# EAGLE design firely (EAGLE 7.7.0)
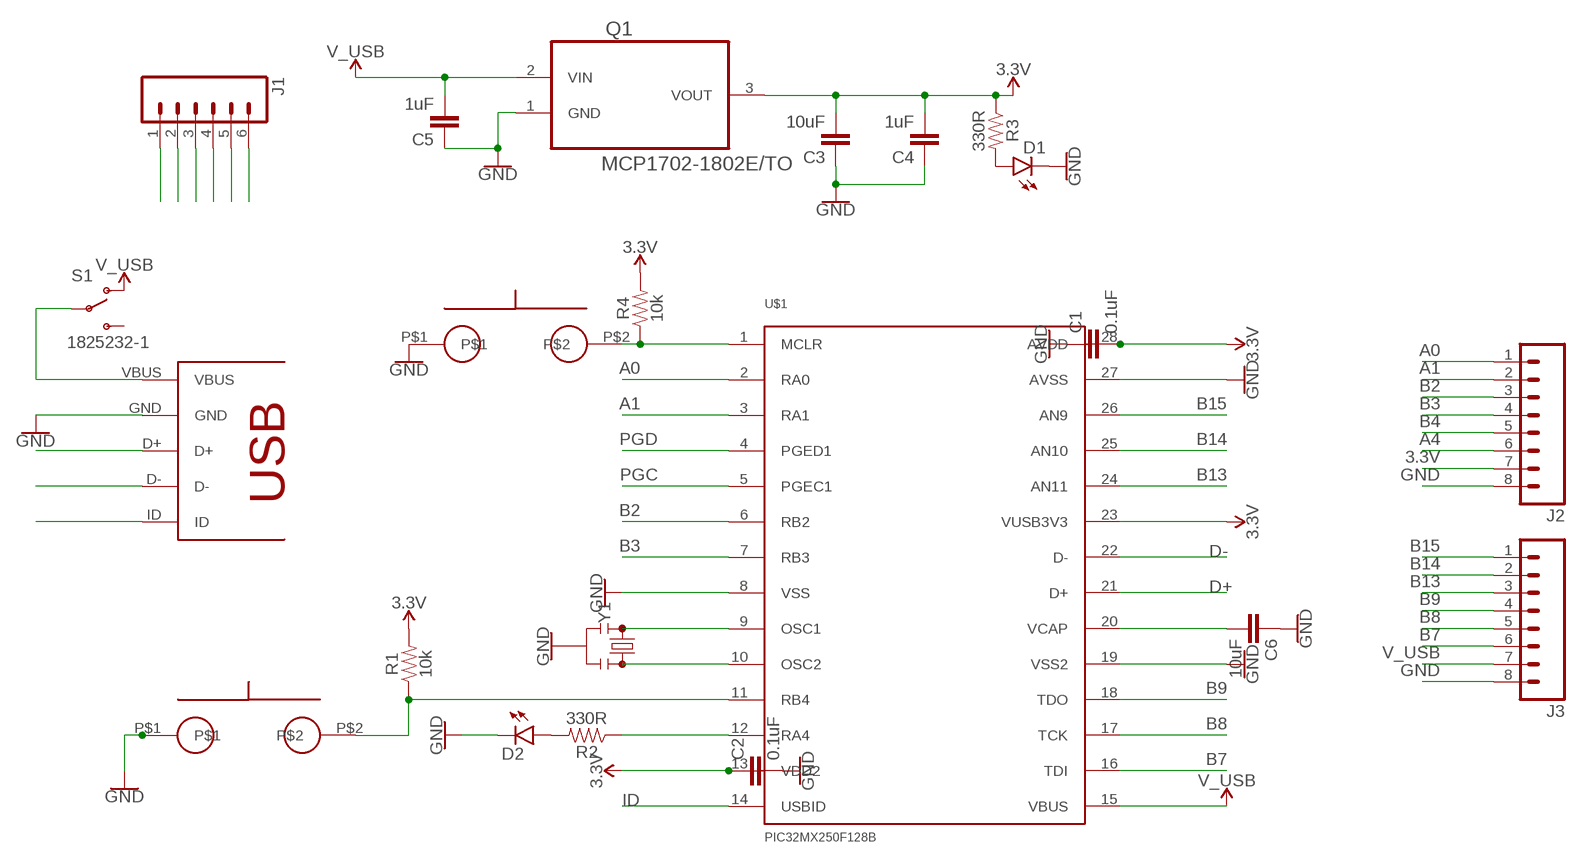
[diagram p0: schematic, sheet 1]

## Parts
C1  0.1uF  CAPVERT_CAP  [PTH_VERT_CAP]
C2  0.1uF  CAPVERT_CAP  [PTH_VERT_CAP]
C3  10uF  CAPVERT_CAP  [PTH_VERT_CAP]
C4  1uF  CAPVERT_CAP  [PTH_VERT_CAP]
C5  1uF  CAPVERT_CAP  [PTH_VERT_CAP]
C6  10uF  CAPVERT_CAP  [PTH_VERT_CAP]
D1  LED3MM  [LED3MM]
D2  LED3MM  [LED3MM]
J1  M06SILK_FEMALE_PTH  [1X06]
J2  M08  [1X08_ROUND]
J3  M08  [1X08_ROUND]
Q1  MCP1702-1802E/TO  [TO127P254X533-3]
R1  10k  1KOHM-HORIZ-1/4W-5%  [AXIAL-0.3]
R2  330R  1KOHM-HORIZ-1/4W-5%  [AXIAL-0.3]
R3  330R  1KOHM-HORIZ-1/4W-5%  [AXIAL-0.3]
R4  10k  1KOHM-HORIZ-1/4W-5%  [AXIAL-0.3]
S1  1825232-1  [1825232-1]
U$1  PIC32MX250F128B  [DIP28]
U$2  EVQ11  [EVQ11]
U$3  USB_FULL  [USB-MB-H]
U$4  EVQ11  [EVQ11]
Y1  RESONATORPTH-7.6X3.8  [RESONATOR-PTH-7.6X3.8]

## Nets
3.3V: C1.P$2 C2.P$1 C3.P$2 C4.P$2 J1.2 J2.7 Q1.3(VOUT) R1.P$2 R3.P$1 R4.P$2 U$1.13(VDD2) U$1.23(VUSB3V3) U$1.28(AVDD)
A0: J2.1 U$1.2(RA0)
A1: J2.2 U$1.3(RA1)
A4: J2.6 R2.P$1 U$1.12(RA4)
B2: J2.3 U$1.6(RB2)
B3: J2.4 U$1.7(RB3)
B4: J2.5 R1.P$1 U$1.11(RB4) U$2.P$2
B7: J3.6 U$1.16(TDI)
B8: J3.5 U$1.17(TCK)
B9: J3.4 U$1.18(TDO)
B13: J3.3 U$1.24(AN11)
B14: J3.2 U$1.25(AN10)
B15: J3.1 U$1.26(AN9)
D+: U$1.21(D+) U$3.D+
D-: U$1.22(D-) U$3.D-
GND: C1.P$1 C2.P$2 C3.P$1 C4.P$1 C5.P$1 C6.P$1 D1.K(C) D2.K(C) J1.3 J2.8 J3.8 Q1.1(GND) U$1.8(VSS) U$1.19(VSS2) U$1.27(AVSS) U$2.P$1 U$3.GND U$4.P$1 Y1.2
ID: U$1.14(USBID) U$3.ID
MCLR: J1.1 R4.P$1 U$1.1(MCLR) U$4.P$2
N$1: D2.A R2.P$2
N$4: S1.2 U$3.VBUS
N$5: D1.A R3.P$2
N$9: U$1.9(OSC1) Y1.1
N$10: U$1.10(OSC2) Y1.3
N$21: J1.6
N$23: C6.P$2 U$1.20(VCAP)
PGC: J1.5 U$1.5(PGEC1)
PGD: J1.4 U$1.4(PGED1)
V_USB: C5.P$2 J3.7 Q1.2(VIN) S1.3 U$1.15(VBUS)
Unconnected: S1.1

## Library data of the parts
C1-C6 = Ilya_Teach:CAP
D1 D2 = SparkFun-LED:LED: LEDs Standard schematic elements and footprints for 5mm, 3mm, 1206, and 0603 sized LEDs. 5mm - Spark Fun Electronics SKU : COM-00529 (and others); PROD_ID: DIO-08794
J1 = SparkFun-Connectors:M06: Header 6 Standard 6-pin 0.1" header. Use with straight break away headers (SKU : PRT-00116), right angle break away headers (PRT-00553), swiss pins (PRT-00743), machine pins (PRT-00117), and female headers (PRT-00115). Molex polarized connector foot print use with SKU : PRT-08094 with associated crimp pins and housings. NOTES ON THE VARIANTS LOCK and LOCK_LONGPADS... This footprint was designed to help hold the alignment of a through-hole component (i.e. 6-pin header) while soldering it into place. You may notice that each hole has been shifted either up or down by 0.005 of an inch from it's more standard position (which is a perfectly straight line). This slight alteration caused the pins (the squares in the middle) to touch the edges of the holes. Because they are alternating, it causes a "brace" to hold the component in place. 0.005 has proven to be the perfect amount of "off-center" position when using our standard breakaway headers. Although looks a little odd when you look at the bare footprint, once you have a header in there, the alteration is very hard to notice. Also,if you push a header all the way into place, it is covered up entirely on the bottom side. This idea of altering the position of holes to aid alignment will be further integrated into the Sparkfun Library for other footprints. It can help hold any component with 3 or more connection pins.; PROD_ID: CONN-08437
J2 J3 = SparkFun-Connectors:M08: Header 8 Standard 8-pin 0.1" header. Use with straight break away headers (SKU : PRT-00116), right angle break away headers (PRT-00553), swiss pins (PRT-00743), machine pins (PRT-00117), and female headers (PRT-00115).; PROD_ID: CONN-08437
Q1 = Microchip_By_element14_Batch_1:MCP1702-1802E/TO: IC, V REG, LDO, 250MA; MPN: MCP1702-1802E/TO; OC_FARNELL: 1331483; OC_NEWARK: 34M7417; PACKAGE: TO-92; SUPPLIER: Microchip
R1-R4 = SparkFun-Resistors:1KOHM: 1kΩ resistor A resistor is a passive two-terminal electrical component that implements electrical resistance as a circuit element. Resistors act to reduce current flow, and, at the same time, act to lower voltage levels within circuits. - Wikipedia; PROD_ID: RES-08380; VALUE: 1k
S1 = genLib:1825232-1
U$1 = SparkFun-IC-Microcontroller:PIC32MX250F128B
U$2 U$4 = Ilya_Teach:EVQ11
U$3 = genLib:USB_FULL
Y1 = SparkFun-Clocks:RESONATOR: Resonators (Generic) Ceramic resonators are clock-generating components, often used to control timing in microcontrollers. They usually have 3 pins: two pins for oscillation, and one pin for ground. Compared to crystals, resonators have worse tolerance, but are usually much cheaper. Plus, they have built-in load capacitors! These devices are used on boards like the Arduino Pro 8MHz <https://www.sparkfun.com/products/11114> and Arduino Pro 16MHz <https://www.sparkfun.com/products/11113>.

## Board
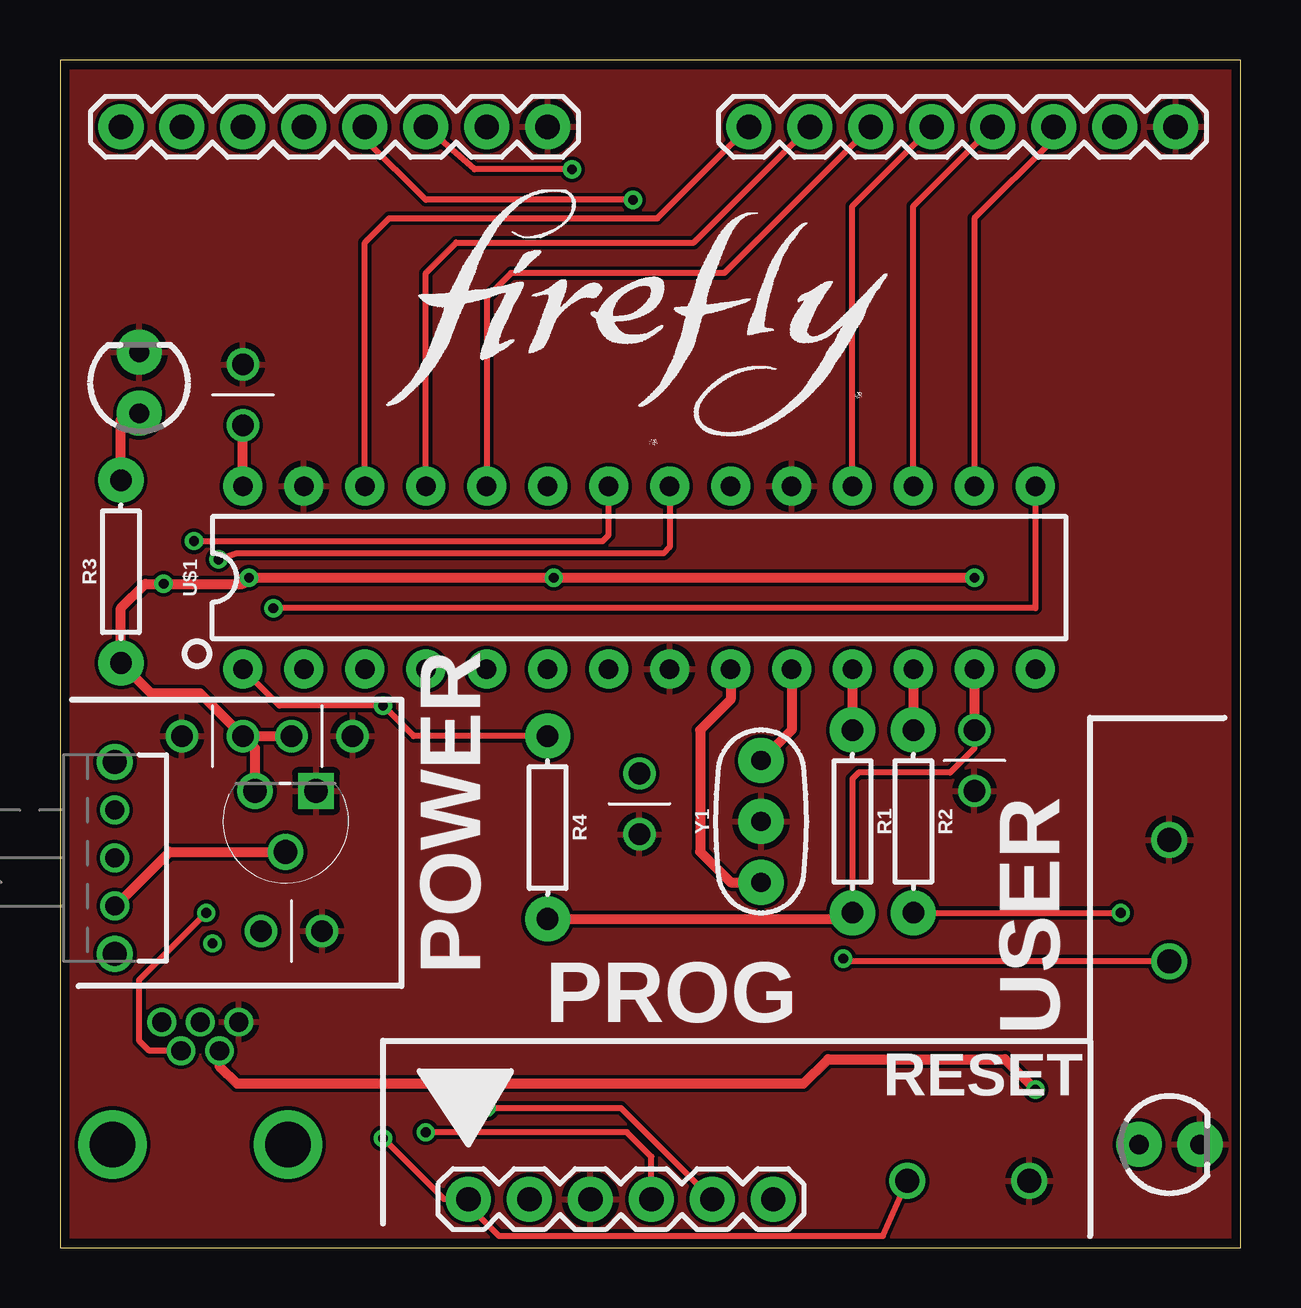
[diagram p1: board, top side]
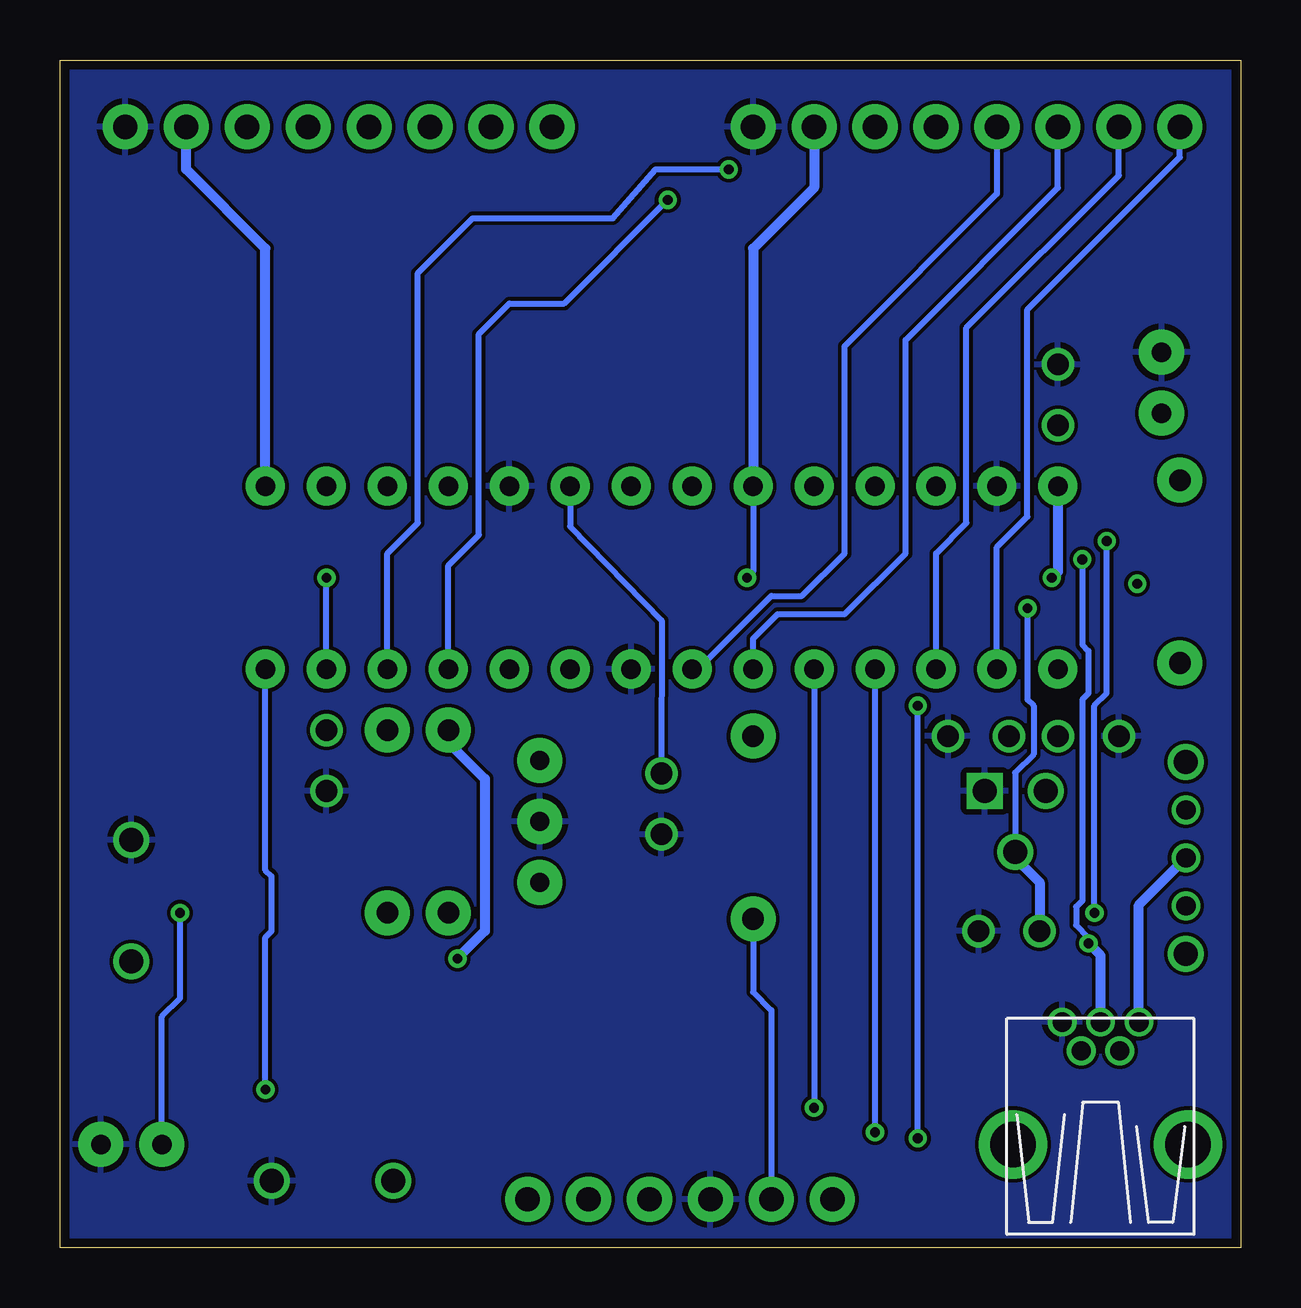
[diagram p2: board, bottom side, seen from below]

Size 49.2 x 49.52 mm. Coordinates in mm from the lower left corner, seen from the top.
Outline: 0,0 49.2,0 49.2,49.52 0,49.52 0,0
Copper layers (1*16): Top 0.0356mm / dielectric 1.5011mm / Bottom 0.0356mm
Design rules "LaenPCBOrder *": minimum track width 6mil, minimum drill 13mil, track to track 6mil, track to pad 6mil, pad to pad 6mil, via to via 6mil, smd to smd 6mil, copper to edge 15mil, drill to drill 6mil, minimum pad ring 7mil, minimum via ring 7mil, stop-mask expansion 3mil, vias tented up to drill 30mil, thermal gap 10mil

### Footprints (pad centres in the part's own frame; a part is rotated, then mirrored left to right if it is on the bottom)
PTH_VERT_CAP = drill 0.9: P$1 -1.27,0; P$2 1.27,0
LED3MM = drill 0.813 pad 1.88: A -1.27,0; K 1.27,0
1X06 = drill 1.016 pad 1.88: 1 0,0; 2 2.54,0; 3 5.08,0; 4 7.62,0; 5 10.16,0; 6 12.7,0
1X08_ROUND = drill 1.016 pad 1.88: 1 0,0; 2 2.54,0; 3 5.08,0; 4 7.62,0; 5 10.16,0; 6 12.7,0; 7 15.24,0; 8 17.78,0
TO127P254X533-3 = drill 0.991 square: 1 -2.54,-2.54 | drill 0.991: 2 -1.27,0; 3 0,-2.54
AXIAL-0.3 = drill 0.9 pad 1.88: P$1 -3.81,0; P$2 3.81,0
1825232-1 = drill 0.8: 1 -2,0; 2 0,0; 3 2,0 | drill 1: P$1 -4,0; P$2 4,0
DIP28 = drill 0.813 pad 1.626: 1 -16.51,-3.81; 2 -13.97,-3.81; 3 -11.43,-3.81; 4 -8.89,-3.81; 5 -6.35,-3.81; 6 -3.81,-3.81; 7 -1.27,-3.81; 8 1.27,-3.81; 9 3.81,-3.81; 10 6.35,-3.81; 11 8.89,-3.81; 12 11.43,-3.81; 13 13.97,-3.81; 14 16.51,-3.81; 15 16.51,3.81; 16 13.97,3.81; 17 11.43,3.81; 18 8.89,3.81; 19 6.35,3.81; 20 3.81,3.81; 21 1.27,3.81; 22 -1.27,3.81; 23 -3.81,3.81; 24 -6.35,3.81; 25 -8.89,3.81; 26 -11.43,3.81; 27 -13.97,3.81; 28 -16.51,3.81
EVQ11 = drill 1: P$1 0,-2.54; P$2 0,2.54
USB-MB-H = drill 0.8: D+ 5.1,0; D- 3.9,0.8; GND 5.1,-1.6; ID 3.9,-0.8; VBUS 5.1,1.6 | drill 1.9: P$6 0,-3.65; P$7 0,3.65
RESONATOR-PTH-7.6X3.8 = drill 0.8 pad 1.88: 1 -2.54,0; 2 0,0; 3 2.54,0

### Placement (x,y rotation side)
C1  7.62,35.56 270 top
C2  38.1,20.32 270 top
C3  6.35,21.34 0 top
C4  10.92,21.34 180 top
C5  9.65,13.21 180 top
C6  24.14,18.51 90 top
D1  3.3,36.07 90 top
D2  46.23,4.32 0 top
J1  17.02,2.03 0 top
J2  2.54,46.74 0 top
J3  28.7,46.74 0 top
Q1  8.13,16.51 180 top
R1  33.02,17.78 270 top
R2  35.56,17.78 270 top
R3  2.54,28.19 90 top
R4  20.32,17.53 270 top
S1  2.29,16.26 270 top
U$1  24.13,27.94 0 top
U$2  46.23,14.48 180 top
U$3  5.84,4.32 90 top
U$4  37.85,2.79 90 top
Y1  29.21,17.78 90 top

### Tracks (layer width: path | path; a pad name or v marks a point on that pad's centre or on a via)
3.3V  (via drill 0.41)
  Top 0.254: C2.P$1 38.1,20.83 37.08,19.81 33.27,19.81 33.02,19.56 R1.P$2
  Top 0.406: U$1.28 C1.P$2 | U$1.13 C2.P$1 | 7.62,27.94 v7.87,27.94 | v7.87,27.94 v20.57,27.94 v38.1,27.94 | v7.87,27.94 7.62,27.69 v4.32,27.69 3.56,27.69 2.54,26.67 R3.P$1 3.81,23.11 5.84,23.11 C3.P$2 | Q1.3 8.13,20.83 C3.P$2 | C3.P$2 C4.P$2 | R4.P$2 32.77,13.72 R1.P$2
  Bottom 0.254: R4.P$2 20.32,10.67 19.56,9.91 J1.2 | U$1.23 20.32,28.19 v20.57,27.94 | U$1.13 v38.1,27.94
  Bottom 0.406: U$1.28 7.62,28.19 v7.87,27.94 | J2.7 17.78,44.2 20.32,41.66 U$1.23
A0
  Bottom 0.254: U$1.2 10.16,29.21 8.89,30.48 8.89,39.12 2.54,45.47 J2.1
A1
  Bottom 0.254: U$1.3 12.7,28.96 11.43,30.23 11.43,38.35 5.08,44.7 J2.2
A4  (via drill 0.41)
  Top 0.254: v21.34,44.96 17.27,44.96 J2.6
  Top 0.406: U$1.12 R2.P$1
  Bottom 0.254: U$1.12 35.56,28.96 34.29,30.23 34.29,40.64 32,42.93 26.16,42.93 24.38,44.96 v21.34,44.96
B2
  Bottom 0.254: U$1.6 20.32,25.4 19.3,26.42 16.51,26.42 13.97,28.96 13.97,37.85 7.62,44.2 J2.3
B3
  Bottom 0.254: J2.4 10.16,43.94 16.51,37.59 16.51,28.96 18.29,27.18 19.56,27.18 22.61,24.13 U$1.7
B4  (via drill 0.41)
  Top 0.254: U$2.P$2 32.77,11.94 v32.64,12.06 | J2.5 12.7,46.23 15.24,43.69 v23.88,43.69
  Top 0.406: U$1.11 R1.P$1
  Bottom 0.254: U$1.11 33.02,28.45 31.75,29.72 31.75,38.1 30.48,39.37 28.19,39.37 v23.88,43.69
  Bottom 0.406: R1.P$1 33.02,21.08 31.5,19.56 31.5,13.21 v32.64,12.06
B7
  Top 0.254: J3.6 41.4,46.23 38.1,42.93 U$1.16
B8
  Top 0.254: U$1.17 35.56,43.43 J3.5
B9
  Top 0.254: U$1.18 33.02,43.43 J3.4
B13
  Top 0.254: J3.3 27.69,40.64 18.8,40.64 17.78,39.62 U$1.24
B14
  Top 0.254: U$1.25 15.24,40.64 16.51,41.91 26.42,41.91 J3.2
B15
  Top 0.254: U$1.26 12.7,41.91 13.72,42.93 24.89,42.93 J3.1
D+  (via drill 0.41)
  Top 0.254: U$1.21 25.4,29.21 25.15,28.96 7.37,28.96 v6.6,28.7
  Bottom 0.254: v6.6,28.7 6.6,25.15 6.35,24.89 6.35,23.11 6.6,22.86 6.6,14.48 6.86,14.22 6.86,13.46 6.35,12.95 v6.35,12.7
  Bottom 0.406: U$3.D+ 5.84,12.19 v6.35,12.7
D-  (via drill 0.41)
  Top 0.254: v5.59,29.46 22.61,29.46 22.86,29.72 U$1.22 | U$3.D- 3.72,8.22 3.3,8.64 3.3,11.18 v6.1,13.97
  Bottom 0.254: v6.1,13.97 6.1,22.61 5.59,23.11 v5.59,29.46
GND
  pour Bottom: 0,49.53 49.53,49.53 49.53,0 0,0
  pour Top: 0,49.53 49.53,49.53 49.53,0 0,0
ID  (via drill 0.41)
  Top 0.406: U$3.ID 6.64,7.58 7.37,6.86 30.99,6.86 32,7.87 39.37,7.87 v40.64,6.6
  Bottom 0.254: v40.64,6.6 40.64,12.95 40.39,13.21 40.39,15.49 40.64,15.75 U$1.14
MCLR  (via drill 0.41)
  Top 0.254: v13.46,4.57 16,2.03 J1.1 17.02,1.78 18.29,0.51 34.29,0.51 U$4.P$2 | U$1.1 9.14,22.61 v13.46,22.61 14.73,21.34 R4.P$1
  Bottom 0.254: v13.46,4.57 v13.46,22.61
N$1  (via drill 0.41)
  Top 0.254: R2.P$2 v44.2,13.97
  Bottom 0.254: D2.A 44.96,9.65 44.2,10.41 v44.2,13.97
N$4
  Bottom 0.406: U$3.VBUS 4.24,14.3 S1.2
N$5
  Top 0.406: R3.P$2 2.54,34.54 D1.A
N$9
  Top 0.406: U$1.9 27.94,22.86 26.67,21.59 26.67,16.51 27.94,15.24 Y1.1
N$10
  Top 0.406: U$1.10 30.48,21.59 Y1.3
N$23
  Bottom 0.254: U$1.20 27.94,30.07 24.13,26.16 C6.P$2
PGC  (via drill 0.41)
  Top 0.254: v17.78,5.84 23.37,5.84 J1.5
  Bottom 0.254: U$1.5 v17.78,5.84
PGD  (via drill 0.41)
  Top 0.254: J1.4 24.64,3.81 23.62,4.83 v15.24,4.83
  Bottom 0.254: v15.24,4.83 U$1.4
V_USB  (via drill 0.41)
  Top 0.254: U$1.15 40.64,26.67 v8.89,26.67
  Top 0.406: S1.3 2.32,14.26 4.57,16.51 Q1.2
  Bottom 0.254: v8.89,26.67 8.89,22.86 8.64,22.61 8.64,20.57 9.4,19.81 Q1.2
  Bottom 0.406: Q1.2 9.4,16.26 8.38,15.24 C5.P$2 | U$1.15 40.64,41.66 43.94,44.96 J3.7

### Text on the board
tPlace: USER | POWER | PROG | RESET